# Altium schematic sheet S7_WiFi.SchDoc
size A3
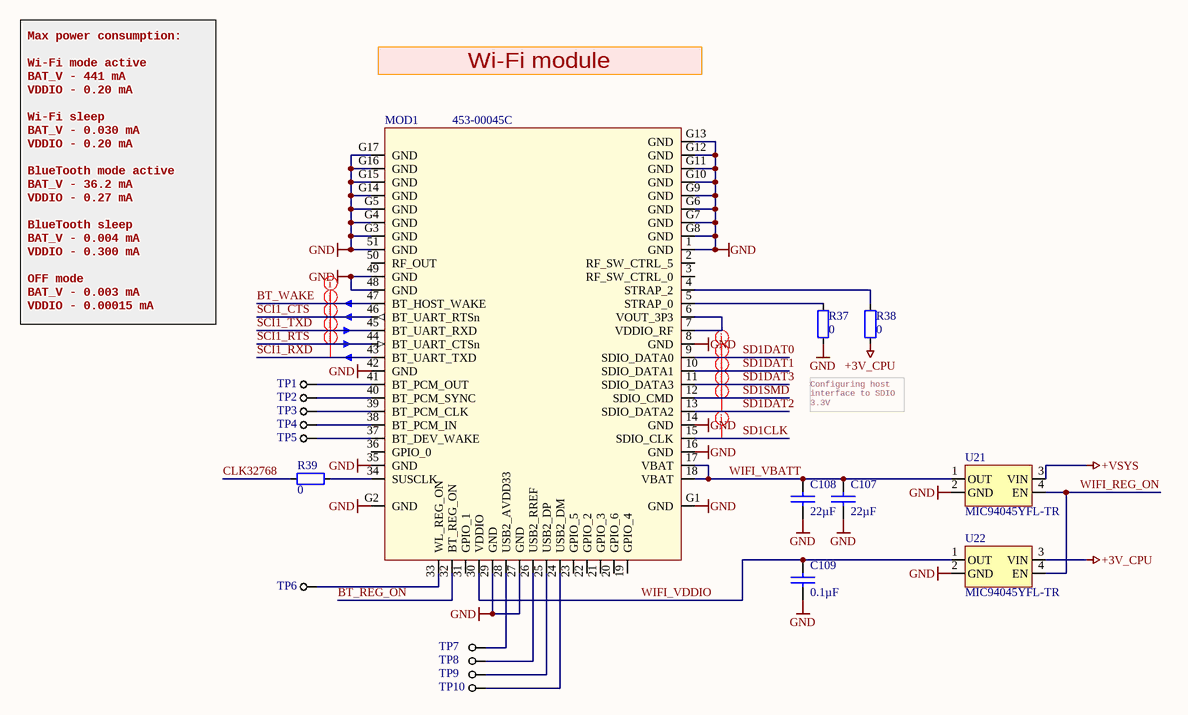
[diagram p0: S7_WiFi.SchDoc]

## Parts
C107  value 22µF  [0603 CAP]  (hidden comment: LMK107BBJ226MA-T)
C108  value 22µF  [0603 CAP]  (hidden comment: LMK107BBJ226MA-T)
C109  value 0.1µF  [0402 CAP]  (hidden comment: 0402B104K500CT)
MOD1  453-00045C  [LWB5+ 453-00045C]
R37  value 0  [0402]  (hidden comment: WR04X000 PTL)
R38  value 0  [0402]  (hidden comment: WR04X000 PTL)
R39  value 0  [0402]  (hidden comment: WR04X000 PTL)
TP1  Test_point 0.5 мм  [Test point 0.5 мм]  (value not drawn)  (net tie, no BOM)
TP2  Test_point 0.5 мм  [Test point 0.5 мм]  (value not drawn)  (net tie, no BOM)
TP3  Test_point 0.5 мм  [Test point 0.5 мм]  (value not drawn)  (net tie, no BOM)
TP4  Test_point 0.5 мм  [Test point 0.5 мм]  (value not drawn)  (net tie, no BOM)
TP5  Test_point 0.5 мм  [Test point 0.5 мм]  (value not drawn)  (net tie, no BOM)
TP6  Test_point 0.5 мм  [Test point 0.5 мм]  (value not drawn)  (net tie, no BOM)
TP7  Test_point 0.5 мм  [Test point 0.5 мм]  (value not drawn)  (net tie, no BOM)
TP8  Test_point 0.5 мм  [Test point 0.5 мм]  (value not drawn)  (net tie, no BOM)
TP9  Test_point 0.5 мм  [Test point 0.5 мм]  (value not drawn)  (net tie, no BOM)
TP10  Test_point 0.5 мм  [Test point 0.5 мм]  (value not drawn)  (net tie, no BOM)
U21  MIC94045YFL-TR  [4-WDFN]
U22  MIC94045YFL-TR  [4-WDFN]

## Nets
+3V_CPU: R38.1 U22.3(VIN)
+VSYS: U21.3(VIN)
GND: C107.2 C108.2 C109.2 MOD1.1(GND) MOD1.8(GND) MOD1.14(GND) MOD1.16(GND) MOD1.27(GND) MOD1.29(GND) MOD1.35(GND) MOD1.42(GND) MOD1.48(GND) MOD1.49(GND) MOD1.51(GND) MOD1.G1(GND) MOD1.G2(GND) MOD1.G3(GND) MOD1.G4(GND) MOD1.G5(GND) MOD1.G6(GND) MOD1.G7(GND) MOD1.G8(GND) MOD1.G9(GND) MOD1.G10(GND) MOD1.G11(GND) MOD1.G12(GND) MOD1.G13(GND) MOD1.G14(GND) MOD1.G15(GND) MOD1.G16(GND) MOD1.G17(GND) R37.1 U21.2(GND) U22.2(GND)
BT_REG_ON: MOD1.32(BT_REG_ON)
BT_WAKE: MOD1.47(BT_HOST_WAKE)
CLK32768: R39.2
SCI1_CTS: MOD1.46(BT_UART_RTSn)
SCI1_RTS: MOD1.44(BT_UART_CTSn)
SCI1_RXD: MOD1.43(BT_UART_TXD)
SCI1_TXD: MOD1.45(BT_UART_RXD)
SD1CLK: MOD1.15(SDIO_CLK)
SD1DAT0: MOD1.9(SDIO_DATA0)
SD1DAT1: MOD1.10(SDIO_DATA1)
SD1DAT2: MOD1.13(SDIO_DATA2)
SD1DAT3: MOD1.11(SDIO_DATA3)
SD1SMD: MOD1.12(SDIO_CMD)
WIFI_REG_ON: U21.4(EN) U22.4(EN)
WIFI_VBATT: C107.1 C108.1 MOD1.17(VBAT) MOD1.18(VBAT) U21.1(OUT)
WIFI_VDDIO: C109.1 MOD1.30(VDDIO) U22.1(OUT)
NetMOD1_4: MOD1.4(STRAP_2) R38.2
NetMOD1_5: MOD1.5(STRAP_0) R37.2
NetMOD1_6: MOD1.6(VOUT_3P3) MOD1.7(VDDIO_RF)
NetMOD1_24: MOD1.24(USB2_DM) TP10.1
NetMOD1_25: MOD1.25(USB2_DP) TP9.1
NetMOD1_26: MOD1.26(USB2_RREF) TP8.1
NetMOD1_28: MOD1.28(USB2_AVDD33) TP7.1
NetMOD1_33: MOD1.33(WL_REG_ON) TP6.1
NetMOD1_34: MOD1.34(SUSCLK) R39.1
NetMOD1_37: MOD1.37(BT_DEV_WAKE) TP5.1
NetMOD1_38: MOD1.38(BT_PCM_IN) TP4.1
NetMOD1_39: MOD1.39(BT_PCM_CLK) TP3.1
NetMOD1_40: MOD1.40(BT_PCM_SYNC) TP2.1
NetMOD1_41: MOD1.41(BT_PCM_OUT) TP1.1

Not connected (* = marked no-connect by the designer): MOD1 2(RF_SW_CTRL_5) 3(RF_SW_CTRL_0) 19(GPIO_4) 20(GPIO_6) 21(GPIO_3) 22(GPIO_2) 23(GPIO_5) 31(GPIO_1) 36(GPIO_0) 50(RF_OUT)

## Layout directives
net class SDIO: SD1CLK, SD1DAT0, SD1DAT1, SD1DAT2, SD1DAT3, SD1SMD
net class CSI1: BT_WAKE, SCI1_CTS, SCI1_RTS, SCI1_RXD, SCI1_TXD

## Notes on the sheet
- Wi-Fi module
- Max power consumption:
  Wi-Fi mode active
  BAT_V - 441 mA
  VDDIO - 0.20 mA
  Wi-Fi sleep
  BAT_V - 0.030 mA
  VDDIO - 0.20 mA
  BlueTooth mode active
  BAT_V - 36.2 mA
  VDDIO - 0.27 mA
  BlueTooth sleep
  BAT_V - 0.004 mA
  VDDIO - 0.300 mA
  OFF mode
  BAT_V - 0.003 mA
  VDDIO - 0.00015 mA
- Configuring host interface to SDIO 3.3V

## Library data of the parts
C107 C108 = LMK107BBJ226MA-T: 22µF, ±20%, 10V, X5R, 0603 (1608 Metric), -55°C ~ 85°C, -, SMPS Filtering; Manufacturer: Taiyo Yuden; PartNum: 587-4913-1-ND; Part Number: LMK107BBJ226MA-T; Distributor: Digi-Key; PartName: LMK107BBJ226MA-T; Price: 0.25810; Tolerance: ±20%; Voltage - Rated: 10V; Temperature Coefficient: X5R; Operating Temperature: -55°C ~ 85°C; Features: -; Package / Case: 0603 (1608 Metric)
C109 = 0402B104K500CT: 0.1µF, ±10%, 50V, X7R, 0402 (1005 Metric), -55°C ~ 125°C, -, General Purpose; Manufacturer: Walsin Technology Corporation; PartNum: 1292-1176-1-ND; Voltage - Rated: 50V; Part Number: 0402B104K500CT; Distributor: Digi-Key; PartName: 0402B104K500CT; Price: 0.19000; Tolerance: ±10%; Temperature Coefficient: X7R; Operating Temperature: -55°C ~ 125°C; Features: -; Package / Case: 0402 (1005 Metric)
MOD1 = CMP-MOD-453-00012-1.4: Module, Sterling LWB5+; Manufacturer: Laird; Substitutes Allowed: NO; Footprint: Laird, Sterling LWB5+ Module, Platform Size; Mounting: SMT; Operating Temperature: -40°C ~ +85°C
R37-R39 = WR04X000 PTL: 0 Ohms Jumper 0.063W, 1/16W Chip Resistor 0402 (1005 Metric) Thick Film; Manufacturer: Walsin Technology Corporation; PartNum: 1292-WR04X000PTLCT-ND; Voltage: 50 V; Distributor: Digi-Key; Price: 0.002$; PartName: WR04X000 PTL
U21 U22 = MIC94045YFL-TR: Power Switch P-Channel, 1.7V ~ 5.5V, 3A, 28 mOhm,   4-MLF® (1.2x1.2), -40...125 C; Manufacturer: Microchip Technology; PartNum: 576-3973-1-ND; Distributor: Digi-Key; price: 067$; PartName: MIC94045YFL-TR